# Altium schematic sheet Schematic.SchDoc
size A4
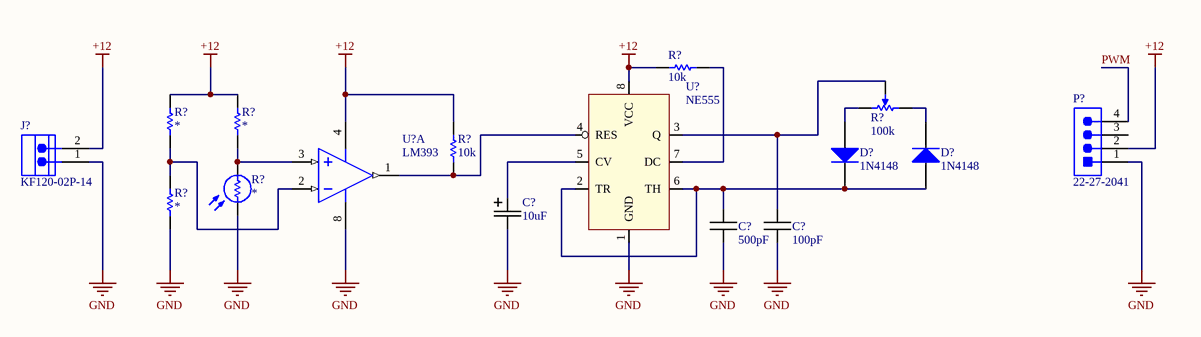
[diagram p0: Schematic.SchDoc]

## Parts
(Parts that share a designator on the sheet are numbered #1, #2 ... from top to bottom, then left to right.)
C?#1  Val: 10uF  [CAP_ELEC_5*11]  (hidden comment: CAP_ELEC_5*11)
C?#2  Val: 500pF  [CAP0805]  (hidden comment: CAP_SMD)
C?#3  Val: 100pF  [CAP0805]  (hidden comment: CAP_SMD)
D?#1  1N4148  [SOD80]
D?#2  1N4148  [SOD80]
J?  KF120-02P-14  [KF350-3.5-02P]
P?  22-27-2041  [MOLX-22-27-2041_V]
R?#1  Val: 10k  [RES0805]  (hidden comment: RES_SMD)
R?#2  value 100k  [BOUR-3296W]  (hidden comment: 3296W)
R?#3  RES_SMD  [RES0805]  (value not drawn)
R?#4  RES_SMD  [RES0805]  (value not drawn)
R?#5  Val: 10k  [RES0805]  (hidden comment: RES_SMD)
R?#6  Photoresistor  [Photoresistor]  (value not drawn)
R?#7  RES_SMD  [RES0805]  (value not drawn)
U?#1  NE555  [DIP8]
U?#2  LM393  [SO-8_N]  (part A of 2)

## Nets
+12: J?.2 P?.2 R?#1.2 R?#3.2 R?#4.2 R?#5.2 U?#1.8(VCC) U?#2.4(GND)
GND: C?#1.1 C?#2.1 C?#3.1 J?.1 P?.1 R?#6.1 R?#7.1 U?#1.1(GND) U?#2.8(V+)
PWM: P?.4
NetC?#1_2: C?#1.2 U?#1.5(CV)
NetC?#2_2: C?#2.2 D?#1.2(K) D?#2.1(A) U?#1.2(TR) U?#1.6(TH)
NetC?#3_2: C?#3.2 R?#2.2 U?#1.3(Q)
NetD?#1_1: D?#1.1(A) R?#2.3
NetD?#2_2: D?#2.2(K) R?#2.1
NetR?#1_1: R?#1.1 U?#1.7(DC)
NetR?#3_1: R?#3.1 R?#7.2 U?#2.2(INA-)
NetR?#4_1: R?#4.1 R?#6.2 U?#2.3(INA+)
NetR?#5_1: R?#5.1 U?#1.4(RES) U?#2.1(OUTA)

Not connected (* = marked no-connect by the designer): P? 3

## Library data of the parts
C?#1 = CAP_ELEC_5*11: Electrolitic capacitor
C?#2 C?#3 = CAP_SMD: Ceramic capacitor, 0805
D?#1 D?#2 = 1N4148: High-Speed Switching Diode, 75 V, 200 mA, -60 to 200 degC, 2-Pin SOD80C, RoHS, Tape and Reel; Manufacturer: NXP Semiconductors; Current - Average Rectified (Io): 200mA(DC); Current - Reverse Leakage @ Vr: 25nA@20V; Online Catalog: StandardDiode; Capacitance @ Vr, F: 4pF@0V,1MHz; Speed: SmallSignal=; Other Names: 568-1749-6; Voltage - Forward (Vf) (Max) @ If: 1V@50mA; Diode Type: Standard; PCN Other: SOD27,66,68,80Package29/Jul/2013; Reverse Recovery Time (trr): 4ns; Voltage - DC Reverse (Vr) (Max): 75V; Mounting Type: SurfaceMount; Package / Case: DO-213AC,MINI-MELF,SOD-80; Family: Diodes,Rectifiers-Single; Package Reference: SOD80C; Standard Package: 1; Operating Temperature - Junction: 200degC(Max); Category: DiscreteSemiconductorProducts; Datasheet URL: http://www.nxp.com/documents/data_sheet/PMLL4148L_PMLL4448.pdf; Package Description: 2-Pin Metal Electrode Face Component, Body 3.5 x 1.525 mm; Supplier Device Package: LLDS;MiniMelf; Manufacturer URL: http://www.nxp.com/; Datasheet Version: Rev. 8, 02/2011; Packaging: Digi-Reel
J? = Terminal_2: Euro Terminal Block, 6 A, 150 V, -40 to 105 degC, Pitch 2.54 mm, 1x2 Position, Height 8.6 mm, Tail Length 3.3 mm; Manufacturer: Cixi KaiFeng; Rated Current: 6 A; Contact: Brass; Insulation Resistance: 5000 MOhm / 1000 V; Rated Voltage: 150 V; No. of Pole: 2; Withstanding Voltage: AC 1500 V / 1 Min; Contact Resistance: 20 mOhm; Pitch: Single Pitch; PackageReference: KF120-2; Color: Green; Mounting Technology: Through Hole; PartNumber: KF120-02P-14; PackageDescription: Terminal Block, Pitch 2.54 mm, 1 x 2 Position, Height 8.6 mm, Tail Length 3.3 mm; ComponentLink2Description: Datasheet; ComponentLink1Description: Manufacturer URL; ComponentLink2URL: http://www.nb-kaifeng.com/upload/editor/ext_pdf/201305290533202245.pdf; Temp. Range: -40 to 105 degC; ComponentLink1URL: http://www.nb-kaifeng.com/
P? = Molex 1x4 2.54 FAN: Male Header, Pitch 2.54 mm, 1 x 4 Position, Height 11.7 mm, Tail Length 3.56 mm, RoHS, Bulk; Manufacturer: Molex; Voltage rating: 250V; Current rating: 4A; Datasheet Version: Rev. F, 06/2009; Operating temperature: 0degCto+75degC; Contact material: Tinplatedbrass; Manufacturer URL: http://www.molex.com/; Housing material: Nylon(UL94V-0); Datasheet URL: http://www.molex.com/pdm_docs/sd/022272041_sd.pdf
R?#2 = Potentiometer: 3296 - 3/8 ” Square Trimpot(R) Trimming Potentiometer,, +/- 10%, 0.5 W, -55 to 125 degC, 3-Pin THD, RoHS, Tube
R?#6 = Photoresistor: PR; Val: *
U?#1 = NE555: NE555, DIP-8
U?#2 = LM393: Low Power Low Offset Voltage Dual Comparator, 8-pin Narrow SOIC, Pb-Free; Manufacturer: Texas Instruments; CompType: Amplifiers; PackageTopMarking: NSZXTT*LM*393M; PowerWise: N; PackageDescription: SOIC Narrow, 4.9 x 3.9 x 1.45mm, 8 Lead, 1.27mm Pitch; ComponentLink1URL: http://www.ti.com/general/docs/lit/getliterature.tsp?genericPartNumber=LM393-N&fileType=pdf; ComponentLink1Description: Datasheet URL; PinCount: 8; RoHS: Y; Code_IPC: SOIC127P600-8; Package Reference: D0008A; Code_JEDEC: MS-012-AA
R?#1 R?#3-R?#5 R?#7 = RES_SMD
  R?#3 R?#4 R?#7: Val: *